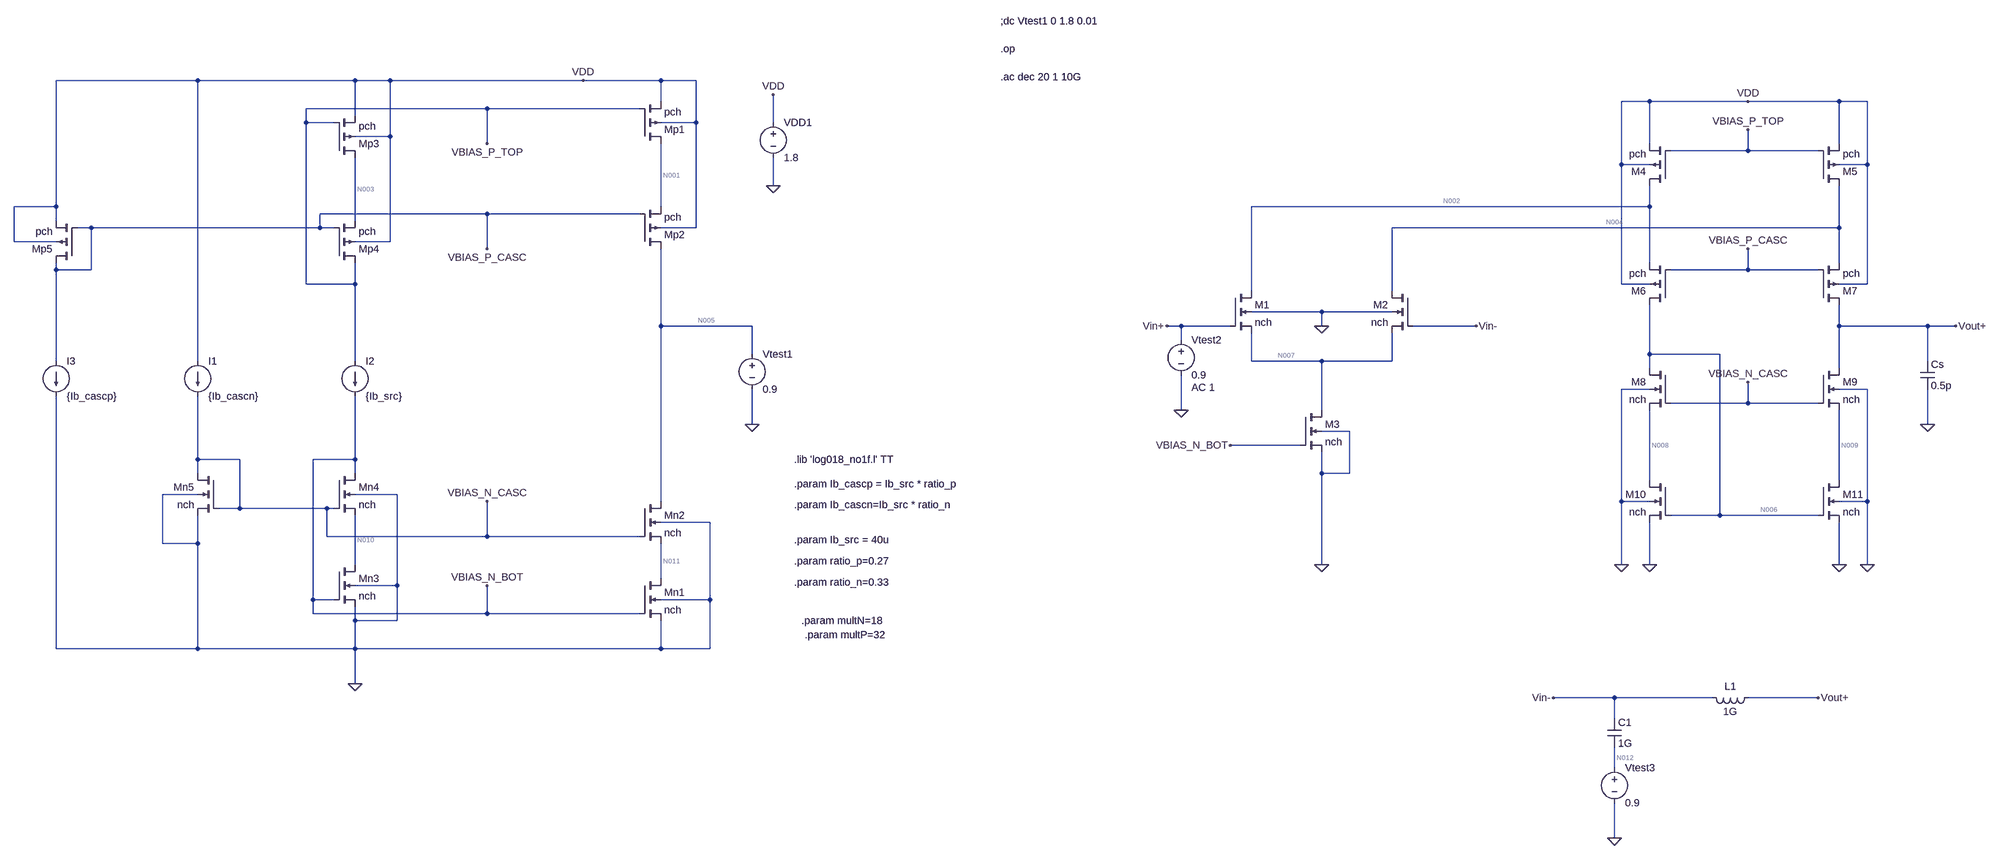
[diagram p0: schematic folded_cascode.asc]
folded_cascode.asc, the LTspice schematic file:
Version 4
SHEET 1 4088 1524
WIRE -1232 -224 -1616 -224
WIRE -832 -224 -1232 -224
WIRE -752 -224 -832 -224
WIRE -16 -224 -752 -224
WIRE 256 -224 -16 -224
WIRE 336 -224 256 -224
WIRE 256 -176 256 -224
WIRE 3168 -176 3104 -176
WIRE 3392 -176 3168 -176
WIRE 3600 -176 3392 -176
WIRE 3664 -176 3600 -176
WIRE -288 -160 -944 -160
WIRE 208 -160 -288 -160
WIRE -832 -144 -832 -224
WIRE -944 -128 -944 -160
WIRE -880 -128 -944 -128
WIRE 336 -128 336 -224
WIRE 336 -128 256 -128
WIRE 512 -128 512 -192
WIRE -752 -96 -752 -224
WIRE -752 -96 -832 -96
WIRE -288 -80 -288 -160
WIRE 3168 -80 3168 -176
WIRE 3600 -80 3600 -176
WIRE 3392 -64 3392 -112
WIRE 3392 -64 3216 -64
WIRE 3552 -64 3392 -64
WIRE 3104 -32 3104 -176
WIRE 3168 -32 3104 -32
WIRE 3664 -32 3664 -176
WIRE 3664 -32 3600 -32
WIRE 512 16 512 -48
WIRE -1616 64 -1616 -224
WIRE -1616 64 -1712 64
WIRE 256 64 256 -80
WIRE 3168 64 3168 16
WIRE 3168 64 2256 64
WIRE -288 80 -912 80
WIRE 208 80 -288 80
WIRE -1616 96 -1616 64
WIRE -832 96 -832 -48
WIRE -1536 112 -1568 112
WIRE -912 112 -912 80
WIRE -912 112 -1536 112
WIRE -880 112 -912 112
WIRE 336 112 336 -128
WIRE 336 112 256 112
WIRE 3600 112 3600 16
WIRE 3600 112 2576 112
WIRE -1712 144 -1712 64
WIRE -1616 144 -1712 144
WIRE -752 144 -752 -96
WIRE -752 144 -832 144
WIRE -288 160 -288 80
WIRE 3168 192 3168 64
WIRE 3600 192 3600 112
WIRE -1616 208 -1616 192
WIRE -1536 208 -1536 112
WIRE -1536 208 -1616 208
WIRE 3392 208 3392 160
WIRE 3392 208 3216 208
WIRE 3552 208 3392 208
WIRE -944 240 -944 -128
WIRE -832 240 -832 192
WIRE -832 240 -944 240
WIRE 3104 240 3104 -32
WIRE 3168 240 3104 240
WIRE 3664 240 3664 -32
WIRE 3664 240 3600 240
WIRE 2256 256 2256 64
WIRE 2576 256 2576 112
WIRE 2416 304 2256 304
WIRE 2576 304 2416 304
WIRE 256 336 256 160
WIRE 464 336 256 336
WIRE 2096 336 2064 336
WIRE 2208 336 2096 336
WIRE 2416 336 2416 304
WIRE 2768 336 2624 336
WIRE 3600 336 3600 288
WIRE 3936 336 3600 336
WIRE 4000 336 3936 336
WIRE 2096 368 2096 336
WIRE 464 400 464 336
WIRE 3168 400 3168 288
WIRE 3328 400 3168 400
WIRE -1616 416 -1616 208
WIRE -1232 416 -1232 -224
WIRE -832 416 -832 240
WIRE 2256 416 2256 352
WIRE 2416 416 2256 416
WIRE 2576 416 2576 352
WIRE 2576 416 2416 416
WIRE 3936 416 3936 336
WIRE 3168 432 3168 400
WIRE 3600 432 3600 336
WIRE 3168 480 3104 480
WIRE 3664 480 3600 480
WIRE 3392 512 3392 464
WIRE 3392 512 3216 512
WIRE 3552 512 3392 512
WIRE 2096 528 2096 448
WIRE 2416 528 2416 416
WIRE 464 560 464 480
WIRE 3936 560 3936 480
WIRE 2480 576 2416 576
WIRE 2368 608 2208 608
WIRE -1232 640 -1232 496
WIRE -1136 640 -1232 640
WIRE -832 640 -832 496
WIRE -832 640 -928 640
WIRE -1232 672 -1232 640
WIRE -832 672 -832 640
WIRE 2416 672 2416 624
WIRE 2480 672 2480 576
WIRE 2480 672 2416 672
WIRE 3168 688 3168 528
WIRE 3600 688 3600 528
WIRE -1232 720 -1312 720
WIRE -736 720 -832 720
WIRE 256 736 256 336
WIRE 3104 736 3104 480
WIRE 3168 736 3104 736
WIRE 3664 736 3664 480
WIRE 3664 736 3600 736
WIRE -1136 752 -1136 640
WIRE -1136 752 -1184 752
WIRE -896 752 -1136 752
WIRE -880 752 -896 752
WIRE 3328 768 3328 400
WIRE 3328 768 3216 768
WIRE 3552 768 3328 768
WIRE 368 784 256 784
WIRE -896 816 -896 752
WIRE -288 816 -288 736
WIRE -288 816 -896 816
WIRE 208 816 -288 816
WIRE -1312 832 -1312 720
WIRE -1232 832 -1232 768
WIRE -1232 832 -1312 832
WIRE -832 880 -832 768
WIRE 2416 880 2416 672
WIRE 3104 880 3104 736
WIRE 3168 880 3168 784
WIRE 3600 880 3600 784
WIRE 3664 880 3664 736
WIRE 256 912 256 832
WIRE -736 928 -736 720
WIRE -736 928 -832 928
WIRE -928 960 -928 640
WIRE -880 960 -928 960
WIRE 368 960 368 784
WIRE 368 960 256 960
WIRE -928 992 -928 960
WIRE -288 992 -288 928
WIRE -288 992 -928 992
WIRE 208 992 -288 992
WIRE -832 1008 -832 976
WIRE -736 1008 -736 928
WIRE -736 1008 -832 1008
WIRE -1616 1072 -1616 496
WIRE -1232 1072 -1232 832
WIRE -1232 1072 -1616 1072
WIRE -832 1072 -832 1008
WIRE -832 1072 -1232 1072
WIRE 256 1072 256 1008
WIRE 256 1072 -832 1072
WIRE 368 1072 368 960
WIRE 368 1072 256 1072
WIRE -832 1152 -832 1072
WIRE 3088 1184 2944 1184
WIRE 3312 1184 3088 1184
WIRE 3552 1184 3392 1184
WIRE 3088 1232 3088 1184
WIRE 3088 1344 3088 1296
WIRE 3088 1504 3088 1424
FLAG -832 1152 0
FLAG 512 16 0
FLAG 512 -192 VDD
FLAG -16 -224 VDD
FLAG 464 560 0
FLAG 3168 880 0
FLAG 3600 880 0
FLAG 3392 -176 VDD
FLAG 3104 880 0
FLAG 3664 880 0
FLAG 2416 880 0
FLAG 2416 336 0
FLAG 2064 336 Vin+
FLAG 2768 336 Vin-
FLAG 4000 336 Vout+
FLAG -288 736 VBIAS_N_CASC
FLAG 3392 464 VBIAS_N_CASC
FLAG -288 -80 VBIAS_P_TOP
FLAG -288 160 VBIAS_P_CASC
FLAG 3392 160 VBIAS_P_CASC
FLAG 3392 -112 VBIAS_P_TOP
FLAG -288 928 VBIAS_N_BOT
FLAG 2208 608 VBIAS_N_BOT
FLAG 3936 560 0
FLAG 2096 528 0
FLAG 3552 1184 Vout+
FLAG 3088 1504 0
FLAG 2944 1184 Vin-
DATAFLAG -832 48 ""
DATAFLAG -832 240 ""
DATAFLAG -832 784 ""
DATAFLAG -832 1008 ""
DATAFLAG -832 -224 ""
DATAFLAG -832 624 ""
DATAFLAG -944 -128 ""
DATAFLAG -752 -96 ""
DATAFLAG -912 960 ""
DATAFLAG -736 928 ""
DATAFLAG -912 112 ""
DATAFLAG -896 752 ""
SYMBOL nmos4 208 912 R0
SYMATTR InstName Mn1
SYMATTR Value2 l=0.5u w=1u m=multN
SYMATTR Value nch
SYMBOL pmos4 208 -80 M180
SYMATTR InstName Mp1
SYMATTR Value2 l=0.5u w=3.3u m=multP
SYMATTR Value pch
SYMBOL nmos4 208 736 R0
SYMATTR InstName Mn2
SYMATTR Value2 l=0.5u w=1u m=multN
SYMATTR Value nch
SYMBOL pmos4 208 160 M180
SYMATTR InstName Mp2
SYMATTR Value2 l=0.5u w=3.3u m=multP
SYMATTR Value pch
SYMBOL nmos4 -880 880 R0
SYMATTR InstName Mn3
SYMATTR Value2 l=0.5u w=1u m=multN
SYMATTR Value nch
SYMBOL pmos4 -880 -48 M180
SYMATTR InstName Mp3
SYMATTR Value2 l=0.5u w=3.3u m=multP
SYMATTR Value pch
SYMBOL nmos4 -880 672 R0
SYMATTR InstName Mn4
SYMATTR Value2 l=0.5u w=1u m=multN
SYMATTR Value nch
SYMBOL pmos4 -880 192 M180
SYMATTR InstName Mp4
SYMATTR Value2 l=0.5u w=3.3u m=multP
SYMATTR Value pch
SYMBOL nmos4 -1184 672 M0
SYMATTR InstName Mn5
SYMATTR Value2 l=0.5u w=1u
SYMATTR Value nch
SYMBOL pmos4 -1568 192 R180
SYMATTR InstName Mp5
SYMATTR Value2 l=0.5u w=3.3u
SYMATTR Value pch
SYMBOL current -1232 416 R0
SYMATTR InstName I1
SYMATTR Value {Ib_cascn}
SYMBOL current -832 416 R0
SYMATTR InstName I2
SYMATTR Value {Ib_src}
SYMBOL current -1616 416 R0
SYMATTR InstName I3
SYMATTR Value {Ib_cascp}
SYMBOL voltage 512 -144 R0
SYMATTR InstName VDD1
SYMATTR Value 1.8
SYMBOL voltage 464 384 R0
WINDOW 123 0 0 Left 0
WINDOW 39 0 0 Left 0
SYMATTR InstName Vtest1
SYMATTR Value 0.9
SYMBOL nmos4 2208 256 R0
SYMATTR InstName M1
SYMATTR Value nch
SYMATTR Value2 l=0.36u w=2u m=8
SYMBOL nmos4 2624 256 M0
SYMATTR InstName M2
SYMATTR Value nch
SYMATTR Value2 l=0.36u w=2u m=8
SYMBOL nmos4 2368 528 R0
SYMATTR InstName M3
SYMATTR Value nch
SYMATTR Value2 l=0.5u w=1u m=16
SYMBOL nmos4 3216 432 M0
SYMATTR InstName M8
SYMATTR Value nch
SYMATTR Value2 l=0.5u w=1u m=12
SYMBOL nmos4 3216 688 M0
SYMATTR InstName M10
SYMATTR Value nch
SYMATTR Value2 l=0.5u w=1u m=12
SYMBOL nmos4 3552 432 R0
SYMATTR InstName M9
SYMATTR Value nch
SYMATTR Value2 l=0.5u w=1u m=12
SYMBOL nmos4 3552 688 R0
SYMATTR InstName M11
SYMATTR Value nch
SYMATTR Value2 l=0.5u w=1u m=12
SYMBOL pmos4 3216 288 R180
SYMATTR InstName M6
SYMATTR Value pch
SYMATTR Value2 l=0.5u w=3.3u m=12
SYMBOL pmos4 3216 16 R180
SYMATTR InstName M4
SYMATTR Value pch
SYMATTR Value2 l=0.5u w=3.3u m=20
SYMBOL pmos4 3552 288 M180
SYMATTR InstName M7
SYMATTR Value pch
SYMATTR Value2 l=0.5u w=3.3u m=12
SYMBOL pmos4 3552 16 M180
SYMATTR InstName M5
SYMATTR Value pch
SYMATTR Value2 l=0.5u w=3.3u m=20
SYMBOL cap 3920 416 R0
SYMATTR InstName Cs
SYMATTR Value 0.5p
SYMBOL voltage 2096 352 R0
WINDOW 123 24 124 Left 2
WINDOW 39 0 0 Left 0
SYMATTR Value2 AC 1
SYMATTR InstName Vtest2
SYMATTR Value 0.9
SYMBOL ind 3408 1168 R90
WINDOW 0 5 56 VBottom 2
WINDOW 3 32 56 VTop 2
SYMATTR InstName L1
SYMATTR Value 1G
SYMBOL voltage 3088 1328 R0
WINDOW 123 24 124 Left 2
WINDOW 39 0 0 Left 0
SYMATTR InstName Vtest3
SYMATTR Value 0.9
SYMBOL cap 3072 1232 R0
SYMATTR InstName C1
SYMATTR Value 1G
TEXT 560 640 Left 2 !.lib 'log018_no1f.l' TT
TEXT 560 696 Left 2 !.param Ib_cascp = Ib_src * ratio_p
TEXT 560 744 Left 2 !.param Ib_cascn=Ib_src * ratio_n
TEXT 560 824 Left 2 !.param Ib_src = 40u
TEXT 560 872 Left 2 !.param ratio_p=0.27
TEXT 560 920 Left 2 !.param ratio_n=0.33
TEXT 1320 -360 Left 2 !;dc Vtest1 0 1.8 0.01
TEXT 576 1008 Left 2 !.param multN=18
TEXT 584 1040 Left 2 !.param multP=32
TEXT 1320 -296 Left 2 !.op
TEXT 1320 -232 Left 2 !.ac dec 20 1 10G

The netlist it stands for:
* folded_cascode.asc
Mn1 N011 VBIAS_N_BOT 0 0 nch l=0.5u w=1u m=multN
Mp1 N001 VBIAS_P_TOP VDD VDD pch l=0.5u w=3.3u m=multP
Mn2 N005 VBIAS_N_CASC N011 0 nch l=0.5u w=1u m=multN
Mp2 N005 VBIAS_P_CASC N001 VDD pch l=0.5u w=3.3u m=multP
Mn3 N010 VBIAS_N_BOT 0 0 nch l=0.5u w=1u m=multN
Mp3 N003 VBIAS_P_TOP VDD VDD pch l=0.5u w=3.3u m=multP
Mn4 VBIAS_N_BOT VBIAS_N_CASC N010 0 nch l=0.5u w=1u m=multN
Mp4 VBIAS_P_TOP VBIAS_P_CASC N003 VDD pch l=0.5u w=3.3u m=multP
Mn5 VBIAS_N_CASC VBIAS_N_CASC 0 0 nch l=0.5u w=1u
Mp5 VBIAS_P_CASC VBIAS_P_CASC VDD VDD pch l=0.5u w=3.3u
I1 VDD VBIAS_N_CASC {Ib_cascn}
I2 VBIAS_P_TOP VBIAS_N_BOT {Ib_src}
I3 VBIAS_P_CASC 0 {Ib_cascp}
VDD1 VDD 0 1.8
Vtest1 N005 0 0.9
M1 N002 Vin+ N007 0 nch l=0.36u w=2u m=8
M2 N004 Vin- N007 0 nch l=0.36u w=2u m=8
M3 N007 VBIAS_N_BOT 0 0 nch l=0.5u w=1u m=16
M8 N006 VBIAS_N_CASC N008 0 nch l=0.5u w=1u m=12
M10 N008 N006 0 0 nch l=0.5u w=1u m=12
M9 Vout+ VBIAS_N_CASC N009 0 nch l=0.5u w=1u m=12
M11 N009 N006 0 0 nch l=0.5u w=1u m=12
M6 N006 VBIAS_P_CASC N002 VDD pch l=0.5u w=3.3u m=12
M4 N002 VBIAS_P_TOP VDD VDD pch l=0.5u w=3.3u m=20
M7 Vout+ VBIAS_P_CASC N004 VDD pch l=0.5u w=3.3u m=12
M5 N004 VBIAS_P_TOP VDD VDD pch l=0.5u w=3.3u m=20
Cs Vout+ 0 0.5p
Vtest2 Vin+ 0 0.9 AC 1
L1 Vout+ Vin- 1G
Vtest3 N012 0 0.9
C1 Vin- N012 1G
.model NMOS NMOS
.model PMOS PMOS
.lib standard.mos
.lib 'log018_no1f.l' TT
.param Ib_cascp = Ib_src * ratio_p
.param Ib_cascn=Ib_src * ratio_n
.param Ib_src = 40u
.param ratio_p=0.27
.param ratio_n=0.33
;dc Vtest1 0 1.8 0.01
.param multN=18
.param multP=32
.op
.ac dec 20 1 10G
.backanno
.end

* Results of the author's LTspice run, read from the files saved beside the schematic
* Operating Point, zero values left out:
*   V(n011) = 113.1 mV
*   V(vbias_n_bot) = 535.4 mV
*   V(n001) = 1.661 V
*   V(vbias_p_top) = 1.295 V
*   V(vdd) = 1.8 V
*   V(n005) = 900 mV
*   V(vbias_n_casc) = 670.2 mV
*   V(vbias_p_casc) = 1.117 V
*   V(n010) = 111.2 mV
*   V(n003) = 1.663 V
*   V(n002) = 1.619 V
*   V(vin+) = 900 mV
*   V(n007) = 339.8 mV
*   V(n004) = 1.621 V
*   V(vin-) = 900 mV
*   V(n006) = 450.2 mV
*   V(n008) = 173.6 mV
*   V(vout+) = 900 mV
*   V(n009) = 176.3 mV
*   V(n012) = 900 mV
*   Id(M2) = 19.77 µA
*   Ib(M2) = -796.4 pA
*   Is(M2) = -19.77 µA
*   Id(M1) = 19.77 µA
*   Ib(M1) = -782.7 pA
*   Is(M1) = -19.77 µA
*   Id(M5) = -25.51 µA
*   Ib(M5) = 3.776 pA
*   Is(M5) = 25.51 µA
*   Id(M7) = -5.739 µA
*   Ib(M7) = 13.19 pA
*   Is(M7) = 5.739 µA
*   Id(M4) = -25.53 µA
*   Ib(M4) = 3.817 pA
*   Is(M4) = 25.53 µA
*   Id(M6) = -5.755 µA
*   Ib(M6) = 18.66 pA
*   Is(M6) = 5.755 µA
*   Id(Mp5) = -10.8 µA
*   Is(Mp5) = 10.8 µA
*   Id(Mp4) = -40 µA
*   Ib(Mp4) = 21.18 pA
*   Is(Mp4) = 40 µA
*   Id(Mp3) = -40 µA
*   Ib(Mp3) = 4.71 pA
*   Is(Mp3) = 40 µA
*   Id(Mp2) = -40.06 µA
*   Ib(Mp2) = 33.9 pA
*   Is(Mp2) = 40.06 µA
*   Id(Mp1) = -40.06 µA
*   Ib(Mp1) = 4.779 pA
*   Is(Mp1) = 40.06 µA
*   Id(M11) = 5.761 µA
*   Ib(M11) = -2.235 pA
*   Is(M11) = -5.761 µA
*   Id(M9) = 5.761 µA
*   Ib(M9) = -13.2 pA
*   Is(M9) = -5.761 µA
*   Id(M10) = 5.755 µA
*   Ib(M10) = -2.204 pA
*   Is(M10) = -5.755 µA
*   Id(M8) = 5.755 µA
*   Ib(M8) = -7.726 pA
*   Is(M8) = -5.755 µA
*   Id(M3) = 39.54 µA
*   Ib(M3) = -5.596 pA
*   Is(M3) = -39.54 µA
*   Id(Mn5) = 13.2 µA
*   Is(Mn5) = -13.2 µA
*   Id(Mn4) = 40 µA
*   Ib(Mn4) = -12 pA
*   Is(Mn4) = -40 µA
*   Id(Mn3) = 40 µA
*   Ib(Mn3) = -2.18 pA
*   Is(Mn3) = -40 µA
*   Id(Mn2) = 40.14 µA
*   Ib(Mn2) = -19.32 pA
*   Is(Mn2) = -40.14 µA
*   Id(Mn1) = 40.14 µA
*   Ib(Mn1) = -2.213 pA
*   Is(Mn1) = -40.14 µA
*   I(C1) = -21.87 nA
*   I(L1) = -21.87 nA
*   I(I3) = 10.8 µA
*   I(I2) = 40 µA
*   I(I1) = 13.2 µA
*   I(Vtest3) = -21.87 nA
*   I(Vtest1) = -76.47 nA
*   I(Vdd1) = -155.1 µA
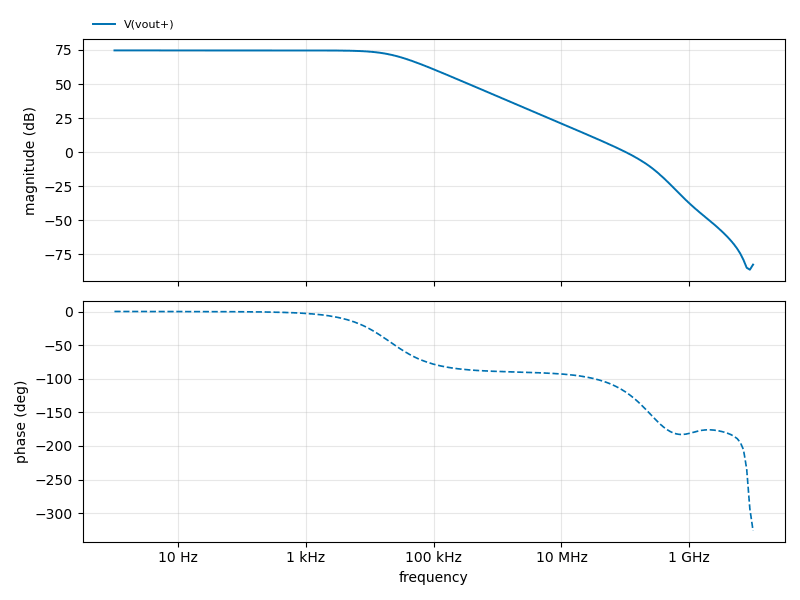
[diagram p1: AC Analysis of folded_cascode.asc, plotted from the saved traces]
* AC Analysis, 1 run:
*   V(vout+): 74.68 dB at 1 Hz, -82.60 dB at 10 GHz, peak 74.68 dB at 7.079 Hz, 3 dB below the peak at 20.54 kHz
* From the log:
*   Semiconductor Device Operating Points:
*                           --- BSIM3 MOSFETS ---
*   Name:        m2          m1          m5          m7          m4
*   Model:      nch.6       nch.6       pch.5       pch.5       pch.5
*   Id:        1.98e-05    1.98e-05   -2.55e-05   -5.74e-06   -2.55e-05
*   Vgs:       5.60e-01    5.60e-01   -5.05e-01   -5.04e-01   -5.05e-01
*   Vds:       1.28e+00    1.28e+00   -1.79e-01   -7.21e-01   -1.81e-01
*   Vbs:      -3.40e-01   -3.40e-01    0.00e+00    1.79e-01    0.00e+00
*   Vth:       5.86e-01    5.86e-01   -4.63e-01   -5.19e-01   -4.63e-01
*   Vdsat:     6.59e-02    6.59e-02   -8.90e-02   -6.50e-02   -8.90e-02
*   Gm:        3.91e-04    3.91e-04    4.23e-04    1.15e-04    4.24e-04
*   Gds:       3.45e-06    3.45e-06    8.77e-06    7.53e-07    8.57e-06
*   Gmb        9.45e-05    9.45e-05    1.41e-04    3.53e-05    1.41e-04
*   Cbd:       0.00e+00    0.00e+00    0.00e+00    0.00e+00    0.00e+00
*   Cbs:       0.00e+00    0.00e+00    0.00e+00    0.00e+00    0.00e+00
*   Cgsov:     5.81e-15    5.81e-15    2.15e-14    1.29e-14    2.15e-14
*   Cgdov:     5.81e-15    5.81e-15    2.15e-14    1.29e-14    2.15e-14
*   Cgbov:     5.17e-16    5.17e-16    2.72e-15    1.63e-15    2.72e-15
*   dQgdVgb:   2.83e-14    2.83e-14    2.11e-13    9.08e-14    2.11e-13
*   dQgdVdb:  -5.80e-15   -5.80e-15   -2.19e-14   -1.29e-14   -2.19e-14
*   dQgdVsb:  -1.43e-14   -1.43e-14   -1.59e-13   -5.10e-14   -1.59e-13
*   dQddVgb:  -5.81e-15   -5.81e-15   -2.40e-14   -1.29e-14   -2.40e-14
*   dQddVdb:   5.81e-15    5.81e-15    2.28e-14    1.29e-14    2.28e-14
*   dQddVsb:   3.45e-18    3.46e-18    2.07e-15    4.64e-17    2.04e-15
*   dQbdVgb:  -8.56e-15   -8.56e-15   -4.25e-14   -3.03e-14   -4.25e-14
*   dQbdVdb:   1.74e-18    1.74e-18   -3.79e-16    8.26e-19   -3.67e-16
*   dQbdVsb:  -1.64e-15   -1.64e-15   -2.81e-14   -7.40e-15   -2.81e-14
*   Name:        m6          mp5         mp4         mp3         mp2
*   Model:      pch.5       pch.5       pch.5       pch.5       pch.5
*   Id:       -5.76e-06   -1.08e-05   -4.00e-05   -4.00e-05   -4.01e-05
*   Vgs:      -5.02e-01   -6.83e-01   -5.46e-01   -5.05e-01   -5.43e-01
*   Vds:      -1.17e+00   -6.83e-01   -3.68e-01   -1.37e-01   -7.61e-01
*   Vbs:       1.81e-01    0.00e+00    1.37e-01    0.00e+00    1.39e-01
*   Vth:      -5.20e-01   -4.63e-01   -5.07e-01   -4.63e-01   -5.07e-01
*   Vdsat:    -6.42e-02   -2.08e-01   -8.87e-02   -8.90e-02   -8.73e-02
*   Gm:        1.15e-04    8.32e-05    6.75e-04    6.58e-04    6.79e-04
*   Gds:       6.98e-07    9.23e-07    5.90e-06    2.82e-05    4.56e-06
*   Gmb        3.54e-05    2.78e-05    2.11e-04    2.19e-04    2.12e-04
*   Cbd:       0.00e+00    0.00e+00    0.00e+00    0.00e+00    0.00e+00
*   Cbs:       0.00e+00    0.00e+00    0.00e+00    0.00e+00    0.00e+00
*   Cgsov:     1.29e-14    1.07e-15    3.43e-14    3.43e-14    3.43e-14
*   Cgdov:     1.29e-14    1.07e-15    3.43e-14    3.43e-14    3.43e-14
*   Cgbov:     1.63e-15    1.36e-16    4.35e-15    4.35e-15    4.35e-15
*   dQgdVgb:   8.94e-14    1.27e-14    3.30e-13    3.38e-13    3.26e-13
*   dQgdVdb:  -1.29e-14   -1.07e-15   -3.44e-14   -3.60e-14   -3.43e-14
*   dQgdVsb:  -4.90e-14   -1.09e-14   -2.50e-13   -2.55e-13   -2.45e-13
*   dQddVgb:  -1.29e-14   -1.09e-15   -3.52e-14   -4.13e-14   -3.45e-14
*   dQddVdb:   1.29e-14    1.08e-15    3.46e-14    3.88e-14    3.44e-14
*   dQddVsb:   1.76e-17    1.59e-17    9.49e-16    4.82e-15    2.39e-16
*   dQbdVgb:  -3.06e-14   -2.00e-15   -6.69e-14   -6.72e-14   -6.76e-14
*   dQbdVdb:   1.60e-18   -2.35e-18   -6.21e-17   -1.26e-15    1.60e-18
*   dQbdVsb:  -7.04e-15   -1.51e-15   -3.88e-14   -4.54e-14   -3.79e-14
*   Name:        mp1         m11         m9          m10         m8
*   Model:      pch.5       nch.8       nch.8       nch.8       nch.8
*   Id:       -4.01e-05    5.76e-06    5.76e-06    5.76e-06    5.76e-06
*   Vgs:      -5.05e-01    4.50e-01    4.94e-01    4.50e-01    4.97e-01
*   Vds:      -1.39e-01    1.76e-01    7.24e-01    1.74e-01    2.77e-01
*   Vbs:       0.00e+00    0.00e+00   -1.76e-01    0.00e+00   -1.74e-01
*   Vth:      -4.63e-01    4.91e-01    5.39e-01    4.91e-01    5.39e-01
*   Vdsat:    -8.90e-02    6.11e-02    6.07e-02    6.11e-02    6.15e-02
*   Gm:        6.59e-04    1.21e-04    1.22e-04    1.21e-04    1.22e-04
*   Gds:       2.69e-05    2.11e-06    7.77e-07    2.16e-06    1.29e-06
*   Gmb        2.19e-04    3.49e-05    3.21e-05    3.48e-05    3.21e-05
*   Cbd:       0.00e+00    0.00e+00    0.00e+00    0.00e+00    0.00e+00
*   Cbs:       0.00e+00    0.00e+00    0.00e+00    0.00e+00    0.00e+00
*   Cgsov:     3.43e-14    4.31e-15    4.31e-15    4.31e-15    4.31e-15
*   Cgdov:     3.43e-14    4.31e-15    4.31e-15    4.31e-15    4.31e-15
*   Cgbov:     4.35e-15    1.08e-15    1.08e-15    1.08e-15    1.08e-15
*   dQgdVgb:   3.38e-13    2.53e-14    2.41e-14    2.53e-14    2.44e-14
*   dQgdVdb:  -3.59e-14   -4.32e-15   -4.31e-15   -4.32e-15   -4.31e-15
*   dQgdVsb:  -2.55e-13   -1.05e-14   -9.79e-15   -1.05e-14   -1.03e-14
*   dQddVgb:  -4.11e-14   -4.40e-15   -4.32e-15   -4.41e-15   -4.35e-15
*   dQddVdb:   3.87e-14    4.34e-15    4.31e-15    4.35e-15    4.32e-15
*   dQddVsb:   4.72e-15    8.70e-17    6.78e-18    8.89e-17    4.01e-17
*   dQbdVgb:  -6.72e-14   -1.06e-14   -1.01e-14   -1.06e-14   -1.00e-14
*   dQbdVdb:  -1.21e-15   -7.73e-18    2.20e-19   -8.06e-18   -1.81e-18
*   dQbdVsb:  -4.53e-14   -1.71e-15   -1.31e-15   -1.71e-15   -1.42e-15
*   Name:        m3          mn5         mn4         mn3         mn2
*   Model:      nch.8       nch.8       nch.8       nch.8       nch.8
*   Id:        3.95e-05    1.32e-05    4.00e-05    4.00e-05    4.01e-05
*   Vgs:       5.35e-01    6.70e-01    5.59e-01    5.35e-01    5.57e-01
*   Vds:       3.40e-01    6.70e-01    4.24e-01    1.11e-01    7.87e-01
*   Vbs:       0.00e+00    0.00e+00   -1.11e-01    0.00e+00   -1.13e-01
*   Vth:       4.91e-01    4.90e-01    5.22e-01    4.91e-01    5.22e-01
*   Vdsat:     9.67e-02    1.85e-01    9.36e-02    9.67e-02    9.24e-02
*   Gm:        6.39e-04    1.16e-04    6.66e-04    6.19e-04    6.71e-04
*   Gds:       7.08e-06    1.11e-06    5.88e-06    7.47e-05    4.09e-06
*   Gmb        1.83e-04    3.28e-05    1.80e-04    1.77e-04    1.81e-04
*   Cbd:       0.00e+00    0.00e+00    0.00e+00    0.00e+00    0.00e+00
*   Cbs:       0.00e+00    0.00e+00    0.00e+00    0.00e+00    0.00e+00
*   Cgsov:     5.75e-15    3.59e-16    6.47e-15    6.47e-15    6.47e-15
*   Cgdov:     5.75e-15    3.59e-16    6.47e-15    6.47e-15    6.47e-15
*   Cgbov:     1.44e-15    9.02e-17    1.62e-15    1.62e-15    1.62e-15
*   dQgdVgb:   5.13e-14    3.78e-15    5.58e-14    5.84e-14    5.53e-14
*   dQgdVdb:  -5.76e-15   -3.60e-16   -6.47e-15   -7.09e-15   -6.46e-15
*   dQgdVsb:  -3.69e-14   -3.07e-15   -3.97e-14   -4.19e-14   -3.90e-14
*   dQddVgb:  -5.92e-15   -3.65e-16   -6.58e-15   -8.41e-15   -6.50e-15
*   dQddVdb:   5.80e-15    3.61e-16    6.49e-15    7.95e-15    6.47e-15
*   dQddVsb:   1.69e-16    4.72e-18    1.17e-16    1.03e-15    3.57e-17
*   dQbdVgb:  -9.95e-15   -5.61e-16   -1.12e-14   -1.08e-14   -1.13e-14
*   dQbdVdb:  -1.18e-17   -4.34e-19   -4.82e-18   -3.53e-16    7.82e-19
*   dQbdVsb:  -7.28e-15   -5.16e-16   -7.21e-15   -8.40e-15   -7.08e-15
*   Name:        mn1
*   Model:      nch.8
*   Id:        4.01e-05
*   Vgs:       5.35e-01
*   Vds:       1.13e-01
*   Vbs:       0.00e+00
*   Vth:       4.91e-01
*   Vdsat:     9.67e-02
*   Gm:        6.22e-04
*   Gds:       7.10e-05
*   Gmb        1.78e-04
*   Cbd:       0.00e+00
*   Cbs:       0.00e+00
*   Cgsov:     6.47e-15
*   Cgdov:     6.47e-15
*   Cgbov:     1.62e-15
*   dQgdVgb:   5.84e-14
*   dQgdVdb:  -7.06e-15
*   dQgdVsb:  -4.19e-14
*   dQddVgb:  -8.34e-15
*   dQddVdb:   7.89e-15
*   dQddVsb:   1.02e-15
*   dQbdVgb:  -1.08e-14
*   dQbdVdb:  -3.38e-16
*   dQbdVsb:  -8.39e-15